# Altium schematic sheet Current_Sensor.SchDoc
size A3; SheetNumber: 2; SheetTotal: 4
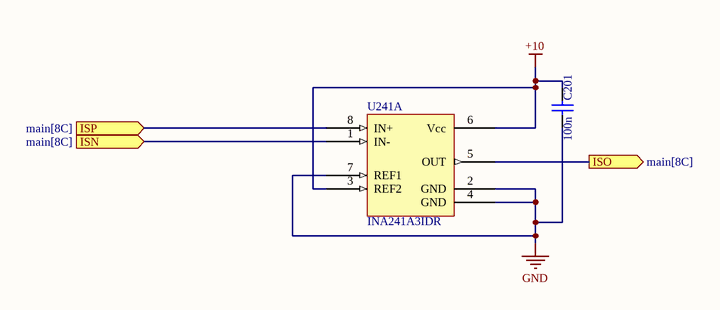
[diagram p0: Current_Sensor.SchDoc]

## Parts
C201  100n  [CAP_1206]
U241A  INA241A3IDR  [SOIC8_M]

## Ports
ISN (in, see main[8C]), ISO (out, see main[8C]), ISP (in, see main[8C])

## Nets
+10: C201.2 U241A.3(REF2) U241A.6(Vcc)
GND: C201.1 U241A.2(GND) U241A.4(GND) U241A.7(REF1)
ISN: U241A.1(IN-) ; port ISN
ISO: U241A.5(OUT) ; port ISO
ISP: U241A.8(IN+) ; port ISP

## Library data of the parts
C201 = CAPN 1206: Non Polarized Capacitor, SMD, 1206
U241A = INA241A3IDR: Current Sense Amp